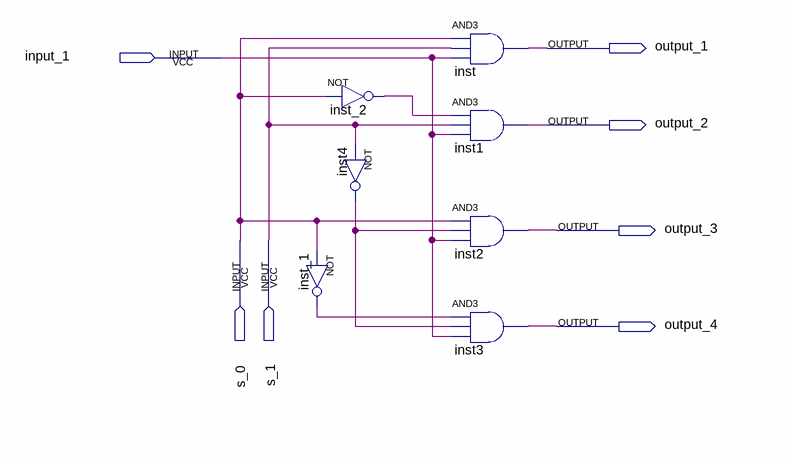
[diagram p0: schematic sheet]
// Quartus schematic Demultiplexer.bdf as structural Verilog: 7 symbols, 7 pins
module Demultiplexer (
  input  input_1,
  input  s_0,
  input  s_1,
  output output_1,
  output output_2,
  output output_3,
  output output_4
);

  wire inst4_out, inst_1_out, inst_2_out;

  not inst_2 (inst_2_out, s_0);
  not inst4 (inst4_out, s_1);
  not inst_1 (inst_1_out, s_0);
  and inst (output_1, s_0, s_1, input_1);
  and inst1 (output_2, inst_2_out, s_1, input_1);
  and inst2 (output_3, s_0, inst4_out, input_1);
  and inst3 (output_4, inst_1_out, inst4_out, input_1);
endmodule
